# Altium schematic sheet 3-PM25-STM32F103C8-170426.SchDoc
size A1
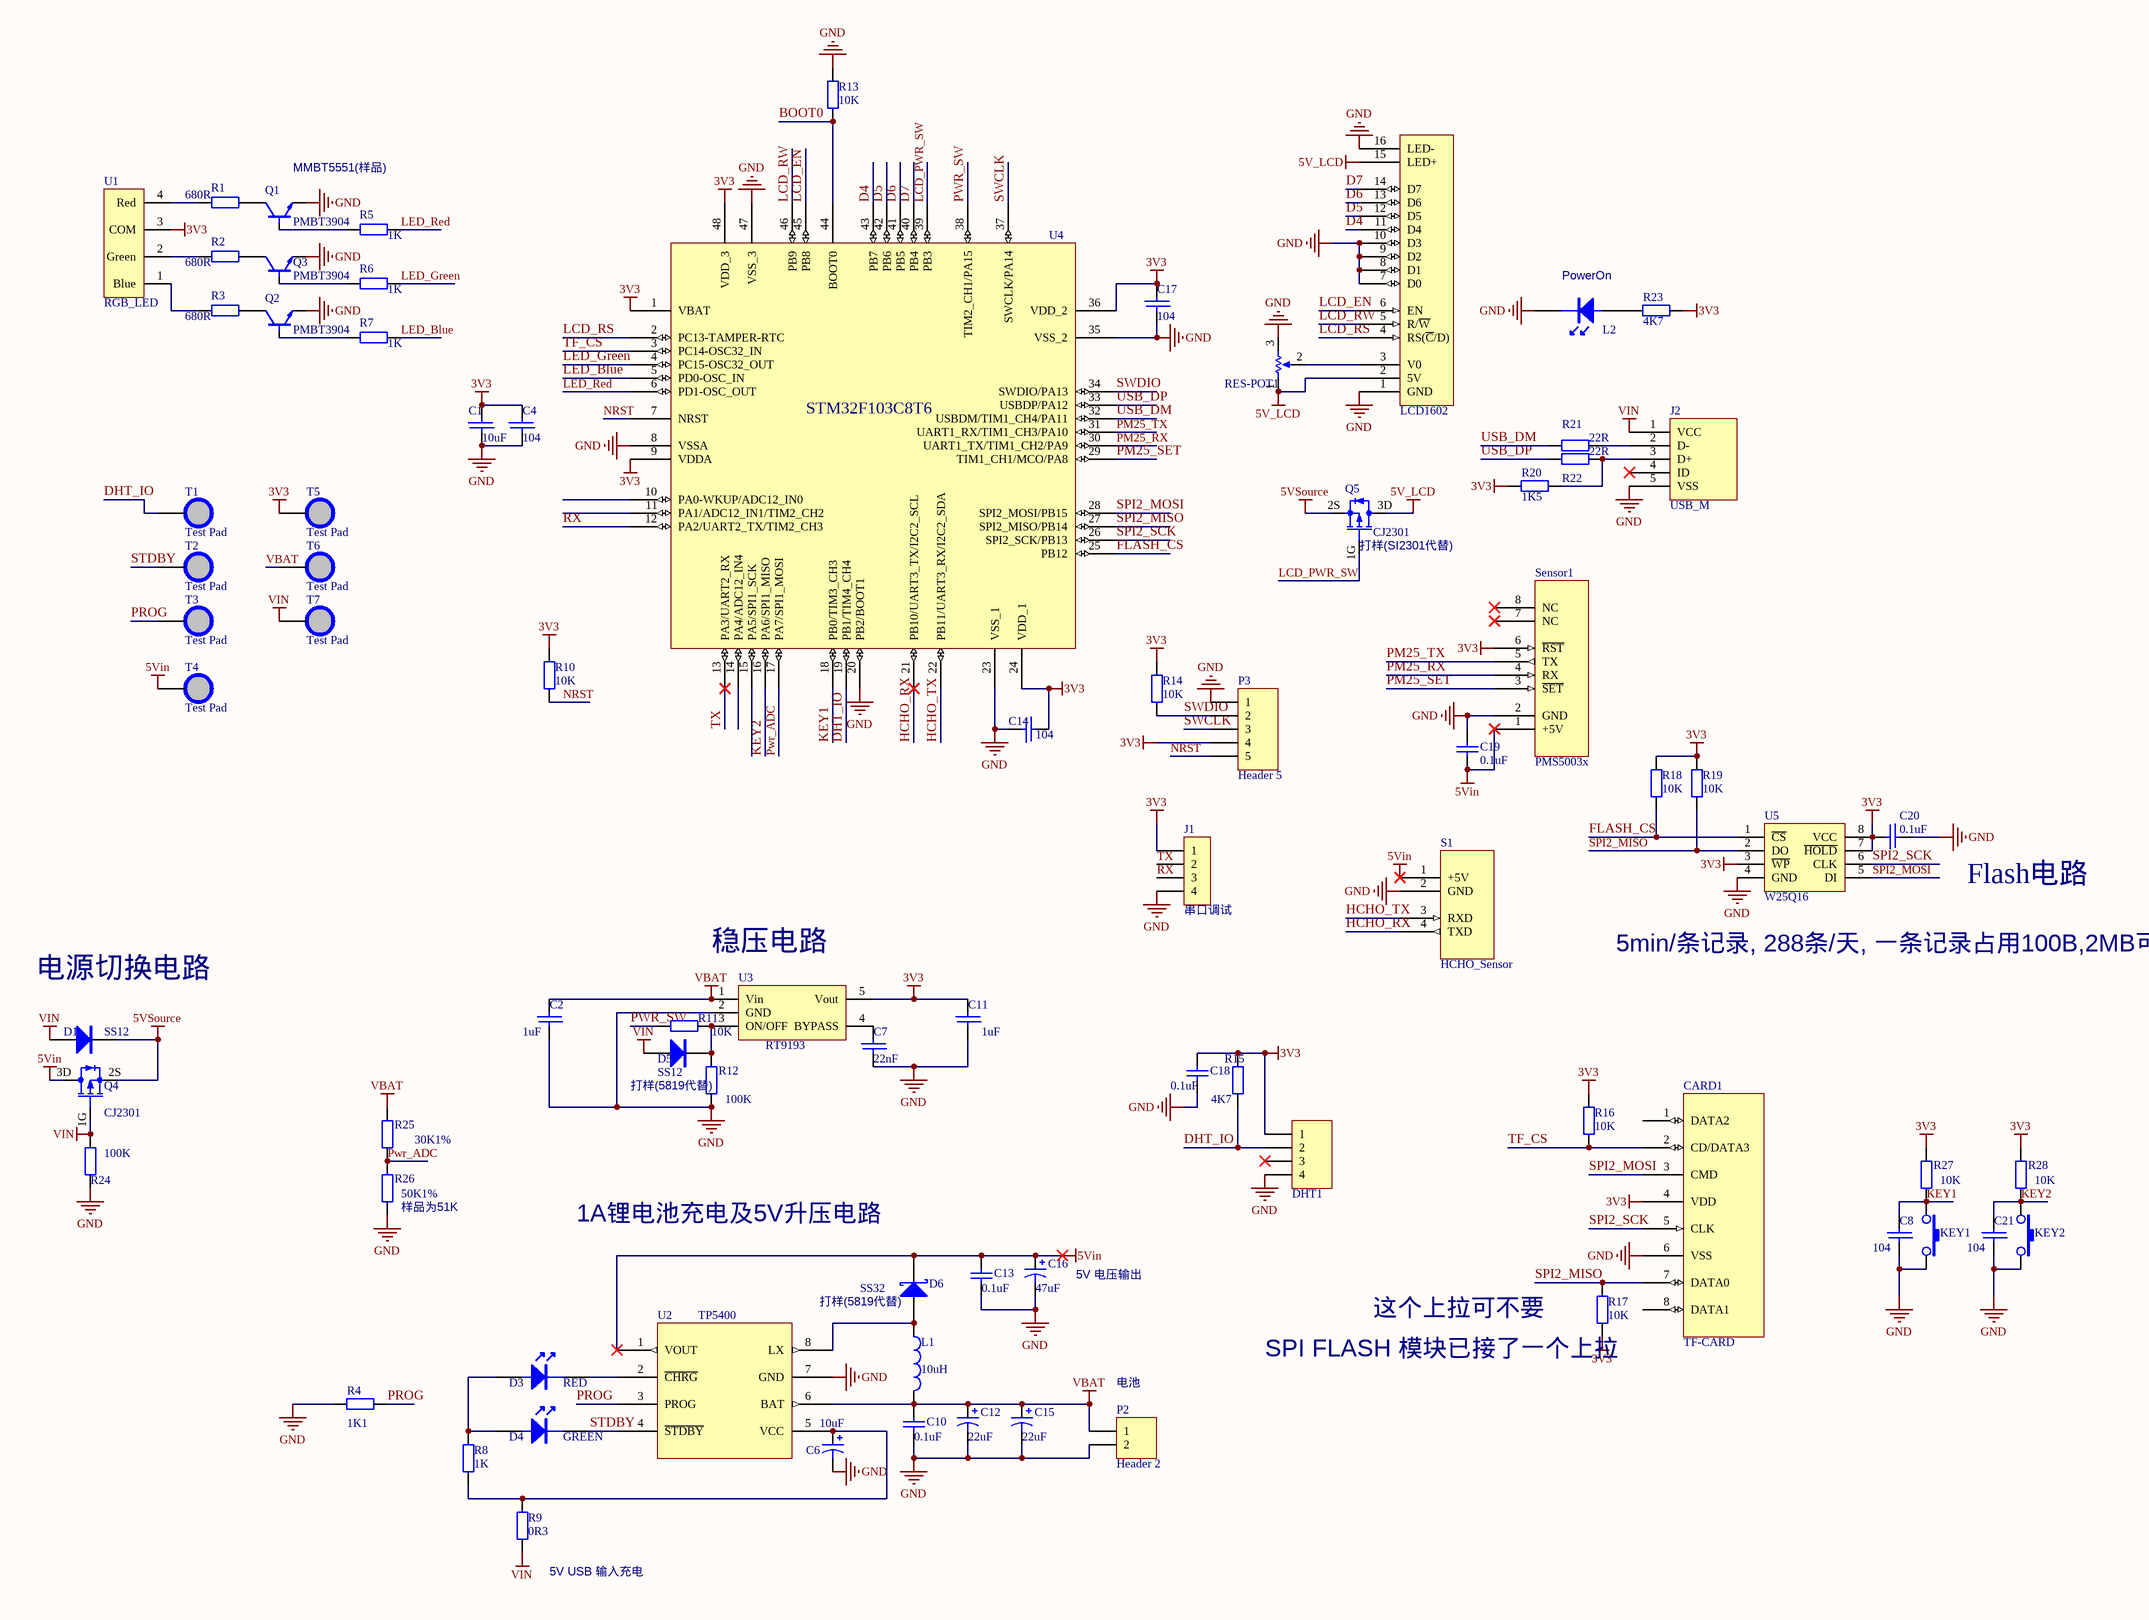
[diagram p0: 3-PM25-STM32F103C8-170426.SchDoc]

## Parts
C1  value 10uF  [LC0805_Std]  (hidden comment: 10uF (106) ±10% 25V,0805)
C2  1uF (105) ±10% 50V ,0603  [LC0603_Std]  (value not drawn)
C4  value 104  [LC0603_Std]  (hidden comment: 100nF(104) ±10% 50V,0603)
C6  value 10uF  [LC0805_Std]  (hidden comment: 10uF (106) ±10% 25V,0805)
C7  22nF (223) ±10% 50V,0603  [LC0603_Std]  (value not drawn)
C8  value 104  [LC0603_Std]  (hidden comment: 100nF (104) ±10% 50V,0603)
C10  value 0.1uF  [LC0603_Std]  (hidden comment: 100nF(104) ±10% 50V,0603)
C11  1uF (105) ±10% 50V ,0603  [LC0603_Std]  (value not drawn)
C12  value 22uF  [LC0805_Std]  (hidden comment: 22uF (226) ±20% 25V,0805)
C13  value 0.1uF  [LC0603_Std]  (hidden comment: 100nF(104) ±10% 50V,0603)
C14  value 104  [LC0603_Std]  (hidden comment: 100nF(104) ±10% 50V,0603)
C15  value 22uF  [LC0805_Std]  (hidden comment: 22uF (226) ±20% 25V,0805)
C16  value 47uF  [Cap-4x7]  (hidden comment: 47uF 16V,4*7,电解电容)
C17  value 104  [LC0603_Std]  (hidden comment: 100nF(104) ±10% 50V,0603)
C18  value 0.1uF  [LC0603_Std]  (hidden comment: 100nF(104) ±10% 50V,0603)
C19  value 0.1uF  [LC0603_Std]  (hidden comment: 100nF(104) ±10% 50V,0603)
C20  100nF(104) ±10% 50V,0603  [LC0603_Std]  (value not drawn)
C21  value 104  [LC0603_Std]  (hidden comment: 100nF (104) ±10% 50V,0603)
CARD1  TF-CARD  [TF-CARD]
D1  5819,SS12  [SOD-123-5819]  (value not drawn)
D3  value RED  [LC0603_Std]  (hidden comment: 红灯,发光二极, C2286,0603)
D4  value GREEN  [LC0603_Std]  (hidden comment: 绿灯,发光二极, C72043, 0603)
D5  5819,SS12  [SOD-123-5819]  (value not drawn)
D6  Name: SS32  [SOD-123-5819]  (hidden comment: B5819W SL,SOD123,SS32,20V,3A,VF=0.55V@3A,DO-214AC)
DHT1  Header 4  [DHT11]  (value not drawn)
J1  串口调试  [HDR1X4]
J2  USB_M  [micro-USB-B]
KEY1  轻触开关  [轻触开关-6x6x6]  (value not drawn)
KEY2  轻触开关  [轻触开关-6x6x6]  (value not drawn)
L1  value 10uH  [LC0603_Std]  (hidden comment: 10uH ±10%,0603)
L2  单色蓝灯, 发光二极管,0603  [LC0603_Std]  (value not drawn)
LCD1  LCD1602  [LCD1602_KS0066]
P2  Header 2  [XH-2A-2P]
P3  Header 5  [HDR1X5]
Q1  PMBT3904  [SOT23-NPN]
Q2  PMBT3904  [SOT23-NPN]
Q3  PMBT3904  [SOT23-NPN]
Q4  CJ2301  [SOT-23_SI2301]
Q5  CJ2301  [SOT-23_SI2301]
R1  value 680R  [LC0603_Std]  (hidden comment: 680Ω (6800) ±1%)
R2  value 680R  [LC0603_Std]  (hidden comment: 680Ω (6800) ±1%)
R3  value 680R  [LC0603_Std]  (hidden comment: 680Ω (6800) ±1%)
R4  value 1K1  [LC0603_Std]  (hidden comment: 1.1KΩ (1101) ±1%,0603)
R5  value 1K  [LC0603_Std]  (hidden comment: 1KΩ (1001) ±1%,0603)
R6  value 1K  [LC0603_Std]  (hidden comment: 1KΩ (1001) ±1%,0603)
R7  value 1K  [LC0603_Std]  (hidden comment: 1KΩ (1001) ±1%,0603)
R8  value 1K  [LC0603_Std]  (hidden comment: 1KΩ (1001) ±1%,0603)
R9  value 0R3  [LC0805_Std]  (hidden comment: 0.3Ω (R300) ±1%,0805)
R10  value 10K  [LC0603_Std]  (hidden comment: 10KΩ (1002) ±1%,0603)
R11  10KΩ (1002) ±1%,0603  [LC0603_Std]  (value not drawn)
R12  100KΩ (1003) ±1%,0603  [LC0603_Std]  (value not drawn)
R13  value 10K  [LC0603_Std]  (hidden comment: 10KΩ (1002) ±1%,0603)
R14  value 10K  [LC0603_Std]  (hidden comment: 10KΩ (1002) ±1%,0603)
R15  value 4K7  [LC0603_Std]  (hidden comment: 4.7KΩ (4701) ±1%,0603)
R16  value 10K  [LC0603_Std]  (hidden comment: 10KΩ (1002) ±1%,0603)
R17  value 10K  [LC0603_Std]  (hidden comment: 10KΩ (1002) ±1%,0603)
R18  value 10K  [LC0603_Std]  (hidden comment: 10KΩ (1002) ±1%,0603)
R19  value 10K  [LC0603_Std]  (hidden comment: 10KΩ (1002) ±1%,0603)
R20  value 1K5  [LC0603_Std]  (hidden comment: 1.5KΩ (1501) ±1%,0603)
R21  value 22R  [LC0603_Std]  (hidden comment: 22Ω (22R0) ±1%,0603)
R22  value 22R  [LC0603_Std]  (hidden comment: 22Ω (22R0) ±1%,0603)
R23  value 4K7  [LC0603_Std]  (hidden comment: 4.7KΩ (4701) ±1%,0603)
R24  100KΩ (1003) ±1%,0603  [LC0603_Std]  (value not drawn)
R25  30KΩ (3002) ±1% ,0603  [LC0603_Std]  (value not drawn)
R26  51KΩ (5102) ±1%  [LC0603_Std]  (value not drawn)
R27  value 10K  [LC0603_Std]  (hidden comment: 10KΩ (1002) ±1%,0603)
R28  value 10K  [LC0603_Std]  (hidden comment: 10KΩ (1002) ±1%,0603)
RES-POT1  RES-POT-RM0065-V1  [RES-POT-RM0065-V1]  (value not drawn)
S1  HCHO_Sensor  [HCHO_Header]
Sensor1  PMS5003x  [PM25_Header]
T1  Test Pad  [TestPoint]
T2  Test Pad  [TestPoint]
T3  Test Pad  [TestPoint]
T4  Test Pad  [TestPoint]
T5  Test Pad  [TestPoint]
T6  Test Pad  [TestPoint]
T7  Test Pad  [TestPoint]
U1  RGB_LED  [LED_RGB]
U2  TP5400  [TP5400-SOP-8]
U3  RT9193  [SOT-23-5_RT9193]
U4  value STM32F103C8T6  [STM32F103C8T6-LQFP-48]  (hidden comment: STM32F103C8T6,LQFP-48)
U5  W25Q16  [SOIC-8_W25Q16JVSS]

## Nets
3V3: C1.2 C4.2 C11.1 C14.1 C17.1 C18.1 C20.1 CARD1.4(VDD) DHT1.1 J1.1 P3.4 R10.2 R14.1 R15.2 R16.1 R17.2 R18.1 R19.1 R20.1 R23.1 R27.2 R28.2 Sensor1.6(~{RST}) T5.1 U1.3(COM) U3.5(Vout) U4.1(VBAT) U4.9(VDDA) U4.24(VDD_1) U4.36(VDD_2) U4.48(VDD_3) U5.3(~{WP}) U5.7(~{HOLD}) U5.8(VCC)
5V_LCD: LCD1.2(5V) LCD1.15(LED+) Q5.3D(D) RES-POT1.1(TOP)
5Vin: C13.2 C16.1 C19.2 D6.2(K) Q4.3D(D) S1.1(+5V) Sensor1.1(+5V) T4.1 U2.1(VOUT)
5VSource: D1.K Q4.2S(S) Q5.2S(S)
GND: C1.1 C2.2 C4.1 C6.2 C7.2 C8.2 C10.1 C11.2 C12.2 C13.1 C14.2 C15.2 C16.2 C17.2 C18.2 C19.1 C20.2 C21.2 CARD1.6(VSS) DHT1.4 J1.4 J2.5(VSS) KEY1.2 KEY2.2 L2.K LCD1.1(GND) LCD1.7(D0) LCD1.8(D1) LCD1.9(D2) LCD1.10(D3) LCD1.16(LED-) P2.2 P3.1 Q1.2(e) Q2.2(e) Q3.2(e) R4.1 R12.2 R13.2 R24.2 R26.2 RES-POT1.3(BOT) S1.2(GND) Sensor1.2(GND) U2.7(GND) U3.2(GND) U4.8(VSSA) U4.20(PB2/BOOT1) U4.23(VSS_1) U4.35(VSS_2) U4.47(VSS_3) U5.4(GND)
VBAT: C2.1 C10.2 C12.1 C15.1 L1.2 P2.1 R25.1 T6.1 U2.6(BAT) U3.1(Vin)
VIN: D1.A D5.A J2.1(VCC) Q4.1G(G) R9.1 R24.1 T7.1
BOOT0: R13.1 U4.44(BOOT0)
D4: LCD1.11(D4) U4.43(PB7)
D5: LCD1.12(D5) U4.42(PB6)
D6: LCD1.13(D6) U4.41(PB5)
D7: LCD1.14(D7) U4.40(PB4)
DHT_IO: DHT1.2 R15.1 T1.1 U4.19(PB1/TIM4_CH4)
FLASH_CS: R18.2 U4.25(PB12) U5.1(~{CS})
HCHO_RX: S1.4(TXD) U4.21(PB10/UART3_TX/I2C2_SCL)
HCHO_TX: S1.3(RXD) U4.22(PB11/UART3_RX/I2C2_SDA)
KEY1: C8.1 KEY1.1 R27.1 U4.18(PB0/TIM3_CH3)
KEY2: C21.1 KEY2.1 R28.1 U4.16(PA6/SPI1_MISO)
LCD_EN: LCD1.6(EN) U4.45(PB8)
LCD_PWR_SW: Q5.1G(G) U4.39(PB3)
LCD_RS: LCD1.4(RS(~{C}/D)) U4.2(PC13-TAMPER-RTC)
LCD_RW: LCD1.5(R/~{W}) U4.46(PB9)
LED_Blue: R7.2 U4.5(PD0-OSC_IN)
LED_Green: R6.1 U4.4(PC15-OSC32_OUT)
LED_Red: R5.1 U4.6(PD1-OSC_OUT)
NRST: P3.5 R10.1 U4.7(NRST)
PM25_RX: Sensor1.4(RX) U4.30(UART1_TX/TIM1_CH2/PA9)
PM25_SET: Sensor1.3(~{SET}) U4.29(TIM1_CH1/MCO/PA8)
PM25_TX: Sensor1.5(TX) U4.31(UART1_RX/TIM1_CH3/PA10)
PROG: R4.2 T3.1 U2.3(PROG)
Pwr_ADC: R25.2 R26.1 U4.17(PA7/SPI1_MOSI)
PWR_SW: R11.1 U4.38(TIM2_CH1/PA15)
RX: J1.3 U4.12(PA2/UART2_TX/TIM2_CH3)
SPI2_MISO: CARD1.7(DATA0) R17.1 R19.2 U4.27(SPI2_MISO/PB14) U5.2(DO)
SPI2_MOSI: CARD1.3(CMD) U4.28(SPI2_MOSI/PB15) U5.5(DI)
SPI2_SCK: CARD1.5(CLK) U4.26(SPI2_SCK/PB13) U5.6(CLK)
STDBY: D4.K T2.1 U2.4(~{STDBY})
SWCLK: P3.3 U4.37(SWCLK/PA14)
SWDIO: P3.2 R14.2 U4.34(SWDIO/PA13)
TF_CS: CARD1.2(CD/DATA3) R16.2 U4.3(PC14-OSC32_IN)
TX: J1.2 U4.13(PA3/UART2_RX)
USB_DM: R21.1 U4.32(USBDM/TIM1_CH4/PA11)
USB_DP: R22.1 U4.33(USBDP/PA12)
NetC6_1: C6.1 R8.2 R9.2 U2.5(VCC)
NetC7_1: C7.1 U3.4(BYPASS)
NetD3_A: D3.A D4.A R8.1
NetD3_K: D3.K U2.2(~{CHRG})
NetD5_K: D5.K R11.2 R12.1 U3.3(ON/OFF)
NetD6_1: D6.1(A) L1.1 U2.8(LX)
NetJ2_2: J2.2(D-) R21.2
NetJ2_3: J2.3(D+) R20.2 R22.2
NetL2_A: L2.A R23.2
NetLCD1_3: LCD1.3(V0) RES-POT1.2(TAP)
NetQ1_1: Q1.1(b) R5.2
NetQ1_3: Q1.3(c) R1.1
NetQ2_1: Q2.1(b) R7.1
NetQ2_3: Q2.3(c) R3.1
NetQ3_1: Q3.1(b) R6.2
NetQ3_3: Q3.3(c) R2.1
NetR1_2: R1.2 U1.4(Red)
NetR2_2: R2.2 U1.2(Green)
NetR3_2: R3.2 U1.1(Blue)

Not connected (* = marked no-connect by the designer): CARD1 1(DATA2) 8(DATA1); DHT1 3*; J2 4(ID)*; Sensor1 7(NC)* 8(NC)*; U4 10(PA0-WKUP/ADC12_IN0) 11(PA1/ADC12_IN1/TIM2_CH2) 14(PA4/ADC12_IN4) 15(PA5/SPI1_SCK)

## Notes on the sheet
- (near Q1) MMBT5551(样品)
- (near L2) PowerOn
- (near Q5) 打样(SI2301代替)
- Flash电路
- (near U3) 稳压电路
- 5min/条记录, 288条/天, 一条记录占用100B,2MB可记录54天
- 电源切换电路
- 打样(5819代替)
- (near R26) 样品为51K
- 1A锂电池充电及5V升压电路
- (near C16) 5V 电压输出
- SPI FLASH 模块已接了一个上拉
- 这个上拉可不要
- (near P2) 电池
- (near R9) 5V USB 输入充电
- (in symbol 二极管) SS12
- (in symbol 普通电容) 0.1uF; 1uF; 22nF
- (in symbol 电阻) 100K; 10K; 50K1%; 30K1%

## Library data of the parts
C1 C2 C4 C7 C8 C11 C14 C17 C20 C21 = 普通电容
C6 C12 C15 C16 = Cap Pol1: Published: 8-Jun-2000; LatestRevisionDate: 17-Jul-2002; LatestRevisionNote: Re-released for DXP Platform.; PackageReference: RB7.6-15; Publisher: Altium Limited
C10 C13 = Cap: Published: 8-Jun-2000; LatestRevisionDate: 17-Jul-2002; LatestRevisionNote: Re-released for DXP Platform.; PackageReference: RAD-0.3; Publisher: Altium Limited
C18 C19 = Cap: Capacitor; Published: 8-Jun-2000; LatestRevisionDate: 17-Jul-2002; LatestRevisionNote: Re-released for DXP Platform.; PackageReference: RAD-0.3; Publisher: Altium Limited
D1 D5 = 二极管
D3 D4 L2 = LED
D6 = D Schottky: Published: 8-Jun-2000; LatestRevisionDate: 17-Jul-2002; LatestRevisionNote: Re-released for DXP Platform.; PackageReference: SMB; Publisher: Altium Limited; Code_JEDEC: DO-214-AA
DHT1 = Header 4: 接插件; LatestRevisionDate: 17-Jul-2002; LatestRevisionNote: Re-released for DXP Platform.; Publisher: Altium Limited
J1 = CON4
J2 = USB_M: MicroUSB接口
L1 = Inductor: Code_IEC: 1005; Published: 8-Jun-2000; LatestRevisionDate: 17-Jul-2002; LatestRevisionNote: Re-released for DXP Platform.; PackageReference: 0402-A; Publisher: Altium Limited; Code_JEITA: 0402
LCD1 = LCD1602_KS0066
P2 = Header 2: Header, 2-Pin; LatestRevisionDate: 17-Jul-2002; LatestRevisionNote: Re-released for DXP Platform.; Publisher: Altium Limited
P3 = Header 5: Header, 5-Pin; LatestRevisionDate: 17-Jul-2002; LatestRevisionNote: Re-released for DXP Platform.; Publisher: Altium Limited
Q1-Q3 = NPN
Q4 Q5 = PMOS
R1-R3 R5-R7 R11 R12 R24-R28 = 电阻
R4 R8 R9 R15 R23 = Res2: Resistor; Published: 8-Jun-2000; LatestRevisionDate: 17-Jul-2002; LatestRevisionNote: Re-released for DXP Platform.; PackageReference: AXIAL-0.4; Publisher: Altium Limited
R10 R13 R14 R16-R22 = Res-C0805: Risistor
Sensor1 = PMS5003x_Sensor
U2 = TP5400: SOIC-8_EP_150mil
U3 = LP2985
U4 = STM32F103C8T6_LQFP48